# Altium schematic sheet US29080671.SchDoc
size A4
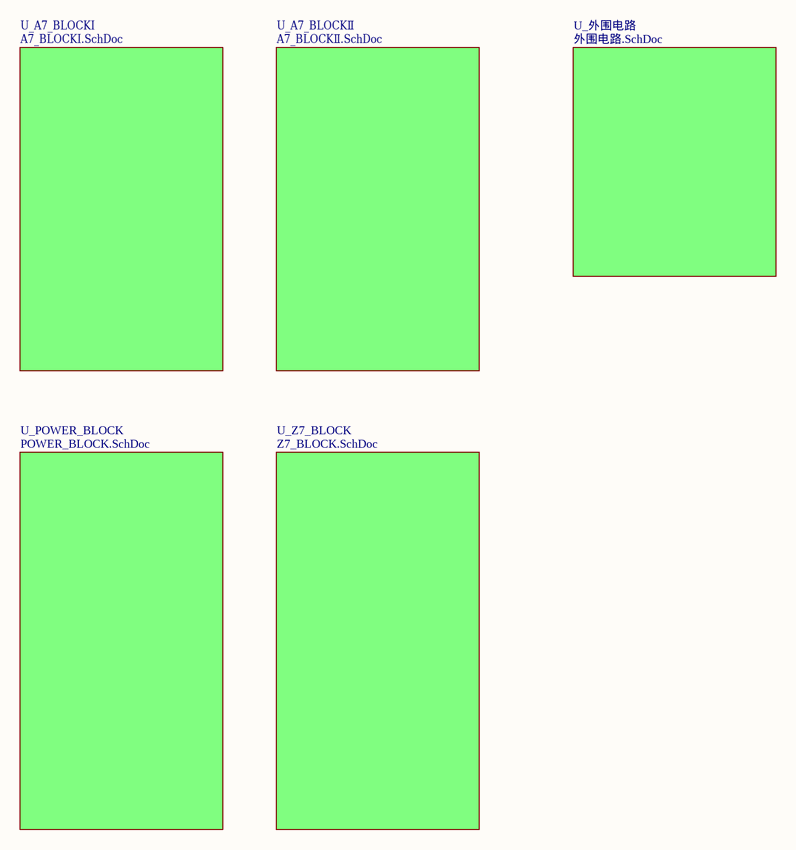
[diagram p0: US29080671.SchDoc]

## Sub-sheets
U_A7_BLOCKⅠ = A7_BLOCKⅠ.SchDoc: no entries
U_A7_BLOCKⅡ = A7_BLOCKⅡ.SchDoc: no entries
U_POWER_BLOCK = POWER_BLOCK.SchDoc: no entries
U_Z7_BLOCK = Z7_BLOCK.SchDoc: no entries
U_外围电路 = 外围电路.SchDoc: no entries